# Altium schematic sheet 48V_0.5A_Converter.SchDoc
size A
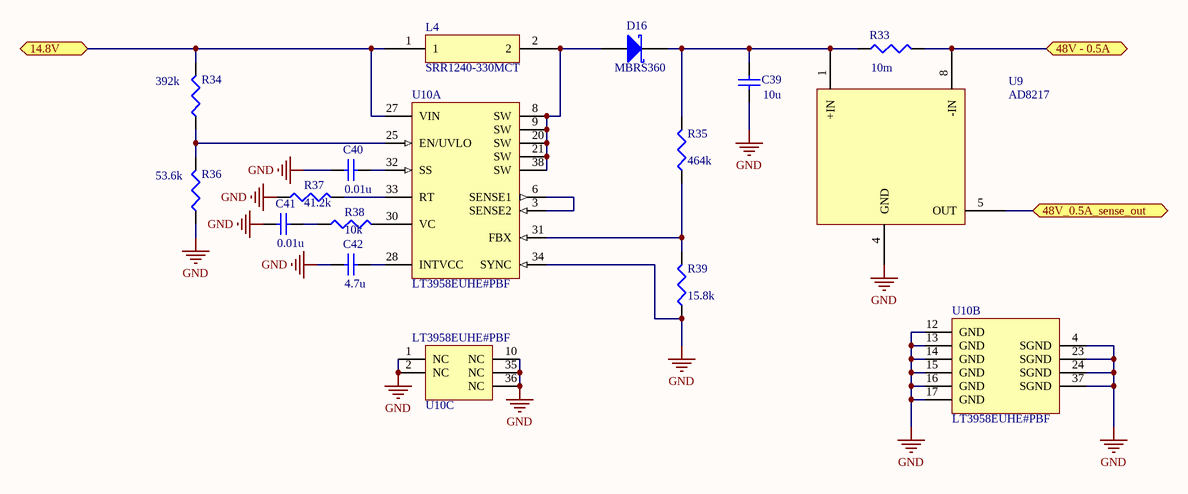
[diagram p0: 48V_0.5A_Converter.SchDoc]

## Parts
C39  value 10u  [C1206]  (hidden comment: Cap Semi)
C40  value 0.01u  [C1206]  (hidden comment: Cap Semi)
C41  value 0.01u  [C1206]  (hidden comment: Cap Semi)
C42  value 4.7u  [C1206]  (hidden comment: Cap Semi)
D16  MBRS360  [SMB]
L4  SRR1240-330MCT  [SRR1240-4R7M]
R33  value 10m  [J1-0603]  (hidden comment: Res3)
R34  value 392k  [J1-0603]  (hidden comment: Res3)
R35  value 464k  [J1-0603]  (hidden comment: Res3)
R36  value 53.6k  [J1-0603]  (hidden comment: Res3)
R37  value 41.2k  [J1-0603]  (hidden comment: Res3)
R38  value 10k  [J1-0603]  (hidden comment: Res3)
R39  value 15.8k  [J1-0603]  (hidden comment: Res3)
U9  AD8217  [AD8217]
U10  LT3958EUHE#PBF  [LT3958]  (parts A,B,C of 3)

## Ports
14.8V, 48V - 0.5A, 48V_0.5A_sense_out

## Nets
GND: C39.1 C40.1 C41.1 C42.1 R36.1 R37.1 R39.1 U9.4(GND) U10.1(NC) U10.2(NC) U10.4(SGND) U10.10(NC) U10.12(GND) U10.13(GND) U10.14(GND) U10.15(GND) U10.16(GND) U10.17(GND) U10.23(SGND) U10.24(SGND) U10.34(SYNC) U10.35(NC) U10.36(NC) U10.37(SGND)
14.8V: L4.1 R34.2 U10.27(VIN) ; port 14.8V
48V - 0.5A: R33.2 U9.8(-IN) ; port 48V - 0.5A
48V_0.5A_sense_out: U9.5(OUT) ; port 48V_0.5A_sense_out
NetC39_2: C39.2 D16.2(K) R33.1 R35.2 U9.1(+IN)
NetC40_2: C40.2 U10.32(SS)
NetC41_2: C41.2 R38.1
NetC42_2: C42.2 U10.28(INTVCC)
NetD16_1: D16.1(A) L4.2 U10.8(SW) U10.9(SW) U10.20(SW) U10.21(SW) U10.38(SW)
NetR34_1: R34.1 R36.2 U10.25(EN/UVLO)
NetR35_1: R35.1 R39.2 U10.31(FBX)
NetR37_2: R37.2 U10.33(RT)
NetR38_2: R38.2 U10.30(VC)
NetU10_3: U10.3(SENSE2) U10.6(SENSE1)

## Library data of the parts
C39-C42 = Cap Semi: Capacitor (Semiconductor SIM Model); Published: 8-Jun-2000; LatestRevisionDate: 29-May-2009; LatestRevisionNote: IPC-7351 Footprint Added.; PackageReference: C1206; Publisher: Altium Limited; PackageDescription: Chip Capacitor
D16 = D Schottky: Schottky Diode; Published: 8-Jun-2000; LatestRevisionDate: 17-Jul-2002; LatestRevisionNote: Re-released for DXP Platform.; PackageReference: SMB; Publisher: Altium Limited; PackageDescription: DO-214-AA/SMB; 2 C-Bend Leads; Body 5.3 x 3.6 mm, inc. leads (LxW); Code_JEDEC: DO-214-AA
L4 = SRR1240-4R7MCT: Inductor
R33-R39 = Res3: Resistor; Published: 8-Jun-2000; LatestRevisionDate: 29-May-2009; LatestRevisionNote: IPC-7351 Footprint Added.; PackageReference: J1-0603; Publisher: Altium Limited; PackageDescription: Chip Resistor
U9 = AD8217: Current Shunt Moniter
U10 = LT3958EUHE#PBF: LT3958; Manufacturer: Linear Technology; Frequency Adjust Range: 100kHz - 1MHz; Number of Outputs: 1; ComponentLink1Description: Manufacturer URL; ComponentLink1URL: http://www.linear.com/; ComponentLink2Description: Datasheet; ComponentLink2URL: http://cds.linear.com/docs/en/datasheet/3958f.pdf; ComponentLink3Description: Package Specification; ComponentLink3URL: http://cds.linear.com/docs/en/packaging/QFN_28_05-08-1836.pdf; Mounting Technology: Surface Mount; PackageDescription: 28-Pin Plastic QFN, Body 5 x 6 mm, Pitch 0.5 mm; PackageReference: UHE-36; PackageVersion: Rev. D, 02/2012; PartNumber: LT3958EUHE#PBF; RoHS: TRUE; Supplier 1: Digi-Key; Supplier 2: Farnell; Supplier 3: Newark; Supplier Part Number 1: LT3958EUHE#PBF-ND; Supplier Part Number 2: 2294964; Supplier Part Number 3: 78R9566